# EAGLE design MosfetBoard (EAGLE 9.6.2)
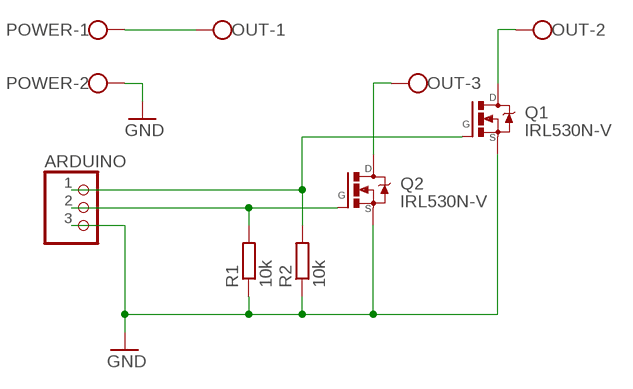
[diagram p0: schematic, sheet 1]

## Parts
ARDUINO  PINHD-1X3  [1X03]
OUT  W237-103  [W237-103]
POWER  W237-102  [W237-102]
Q1  IRL530N-V  [TO220V]
Q2  IRL530N-V  [TO220V]
R1  10k  R-EU_0207/10  [0207/10]
R2  10k  R-EU_0207/10  [0207/10]

## Nets
GND [power]: ARDUINO.3 POWER.2 Q1.3(S) Q2.3(S) R1.1 R2.1
N$1 [power]: OUT.1 POWER.1
N$2: ARDUINO.2 Q2.1(G) R1.2
N$3 [power]: OUT.3 Q2.2(D)
N$4 [power]: OUT.2 Q1.2(D)
POS_A: ARDUINO.1 Q1.1(G) R2.2

## Library data of the parts
ARDUINO = pinhead:PINHD-1X3: PIN HEADER
OUT = con-wago-500:W237-103: WAGO SCREW CLAMP; MPN: 237-103; OC_FARNELL: unknown; OC_NEWARK: 18M7116
POWER = con-wago-500:W237-102: WAGO SCREW CLAMP; MPN: 237-102; OC_FARNELL: unknown; OC_NEWARK: 70K9898
Q1 Q2 = transistor-fet:IRL530: MOSFET 17A 22.7nC 100mOhm Logic Level
R1 R2 = rcl:R-EU_: RESISTOR, European symbol; SPICEPREFIX: R

## Net classes
1 power: width 1.016 mm

## Board
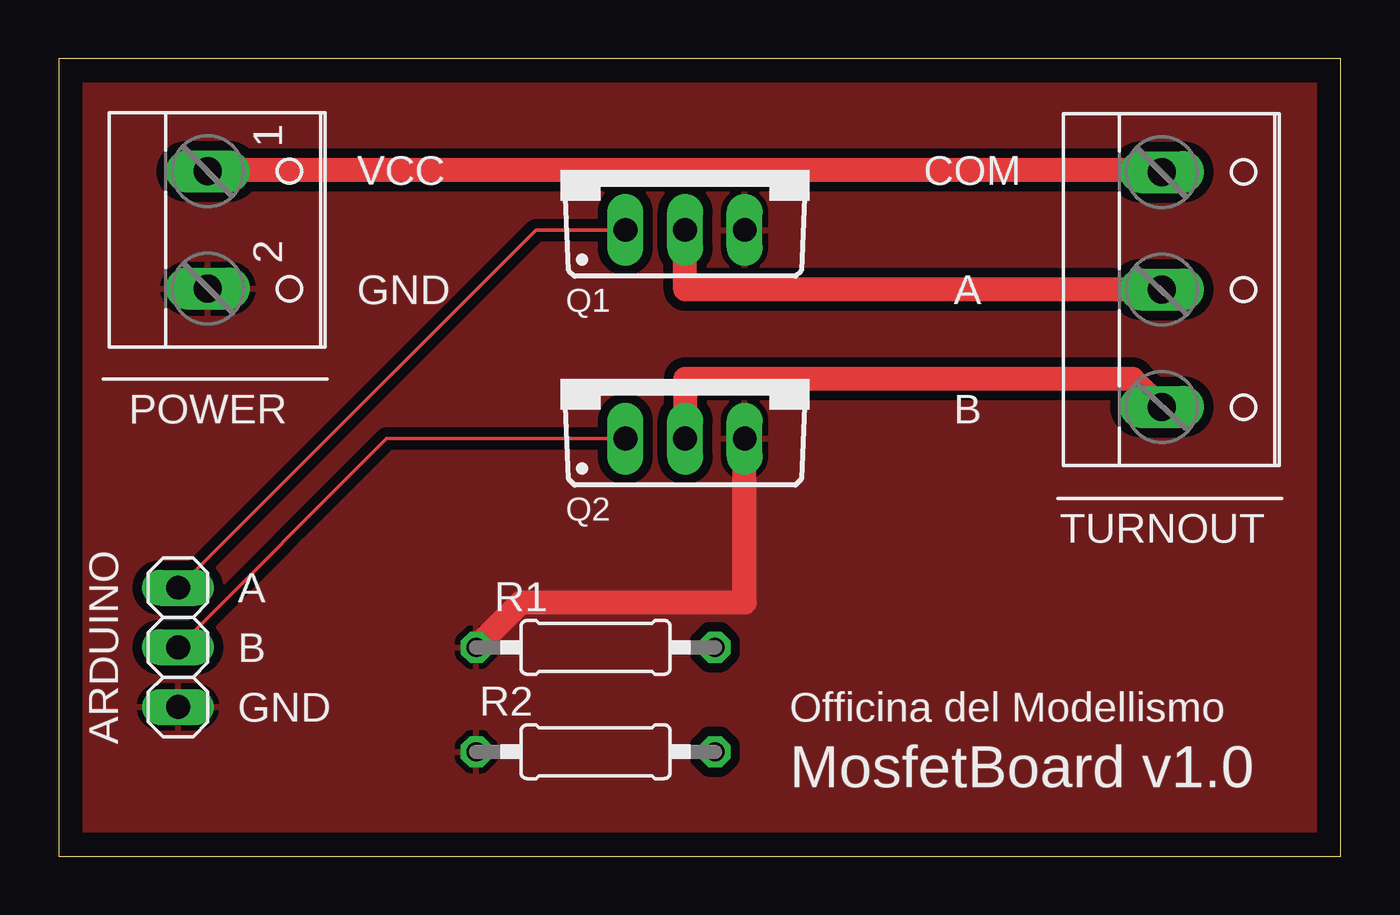
[diagram p1: board, top side]
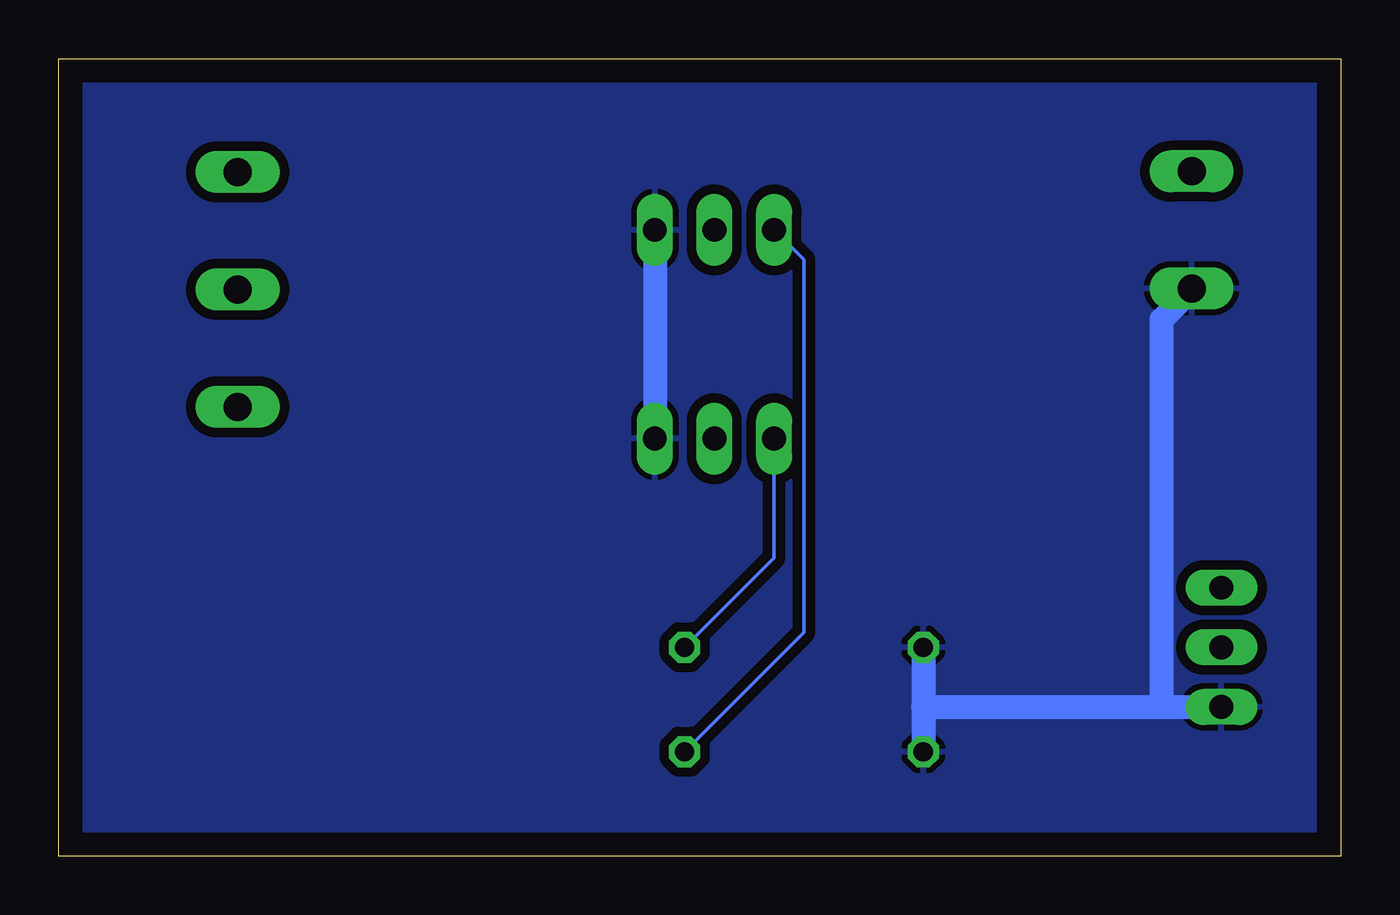
[diagram p2: board, bottom side, seen from below]

Size 54.59 x 33.96 mm. Coordinates in mm from the lower left corner, seen from the top.
Outline: 0,0 54.59,0 54.59,33.96 0,33.96 0,0
Copper layers (1*16): Top 0.035mm / dielectric 1.5mm / Bottom 0.035mm
Design rules "default": minimum track width 6mil, minimum drill 0.35mm, track to track 6mil, track to pad 6mil, pad to pad 6mil, via to via 6mil, smd to smd 6mil, copper to edge 40mil, drill to drill 6mil, minimum pad ring 10mil, minimum via ring 8mil, stop-mask expansion 4mil, vias tented up to drill 0mil, thermal gap 10mil

### Footprints (pad centres in the part's own frame; a part is rotated, then mirrored left to right if it is on the bottom)
1X03 = drill 1.016 long: 1 -2.54,0; 2 0,0; 3 2.54,0
W237-103 = drill 1.194 long: 1 -5,-1.29; 2 0,-1.29; 3 5,-1.29
W237-102 = drill 1.194 long: 1 -2.5,-1.27; 2 2.5,-1.27
TO220V = drill 1.016 long: 1 -2.54,-2.54; 2 0,-2.54; 3 2.54,-2.54
0207/10 = drill 0.813 octagon: 1 -5.08,0; 2 5.08,0

### Placement (x,y rotation side)
ARDUINO  5.08,8.89 270 top
OUT  48.26,24.13 270 top
POWER  7.62,26.67 270 top
Q1  26.67,29.21 0 top
Q2  26.67,20.32 0 top
R1  22.86,8.89 0 top
R2  22.86,4.45 0 top

### Tracks (layer width: path | path; a pad name or v marks a point on that pad's centre or on a via)
GND
  Top 1.016: Q2.3 29.21,10.79 19.68,10.79 R1.1
  Bottom 1.016: Q1.3 Q2.3 | R1.1 17.78,6.35 | 17.78,6.35 R2.1 | 17.78,6.35 7.62,6.35 | 7.62,6.35 ARDUINO.3 | 7.62,6.35 7.62,22.86 6.35,24.13 POWER.2
  pour Top (isolate 0.406): -0.64,34.29 55.24,34.29 55.24,-0.64 -0.64,-0.64
  pour Bottom (isolate 0.406): -0.64,34.29 55.24,34.29 55.24,-0.64 -0.64,-0.64
N$1
  Top 1.016: POWER.1 6.35,29.21 46.35,29.21 OUT.1
N$2
  Top 0.152: ARDUINO.2 13.97,17.78 Q2.1
  Bottom 0.152: R1.2 24.13,12.7 Q2.1
N$3
  Top 1.016: Q2.2 26.67,20.32 45.72,20.32 46.35,19.68 OUT.3
N$4
  Top 1.016: Q1.2 26.67,24.13 OUT.2
POS_A
  Top 0.152: ARDUINO.1 20.32,26.67 Q1.1
  Bottom 0.152: R2.2 22.86,9.53 22.86,25.4 Q1.1

### Text on the board
tPlace: VCC | COM | GND | A | POWER | B | TURNOUT | A | ARDUINO | B | GND | Officina del Modellismo | MosfetBoard v1.0